# Altium project MBOARD.PRJPCB
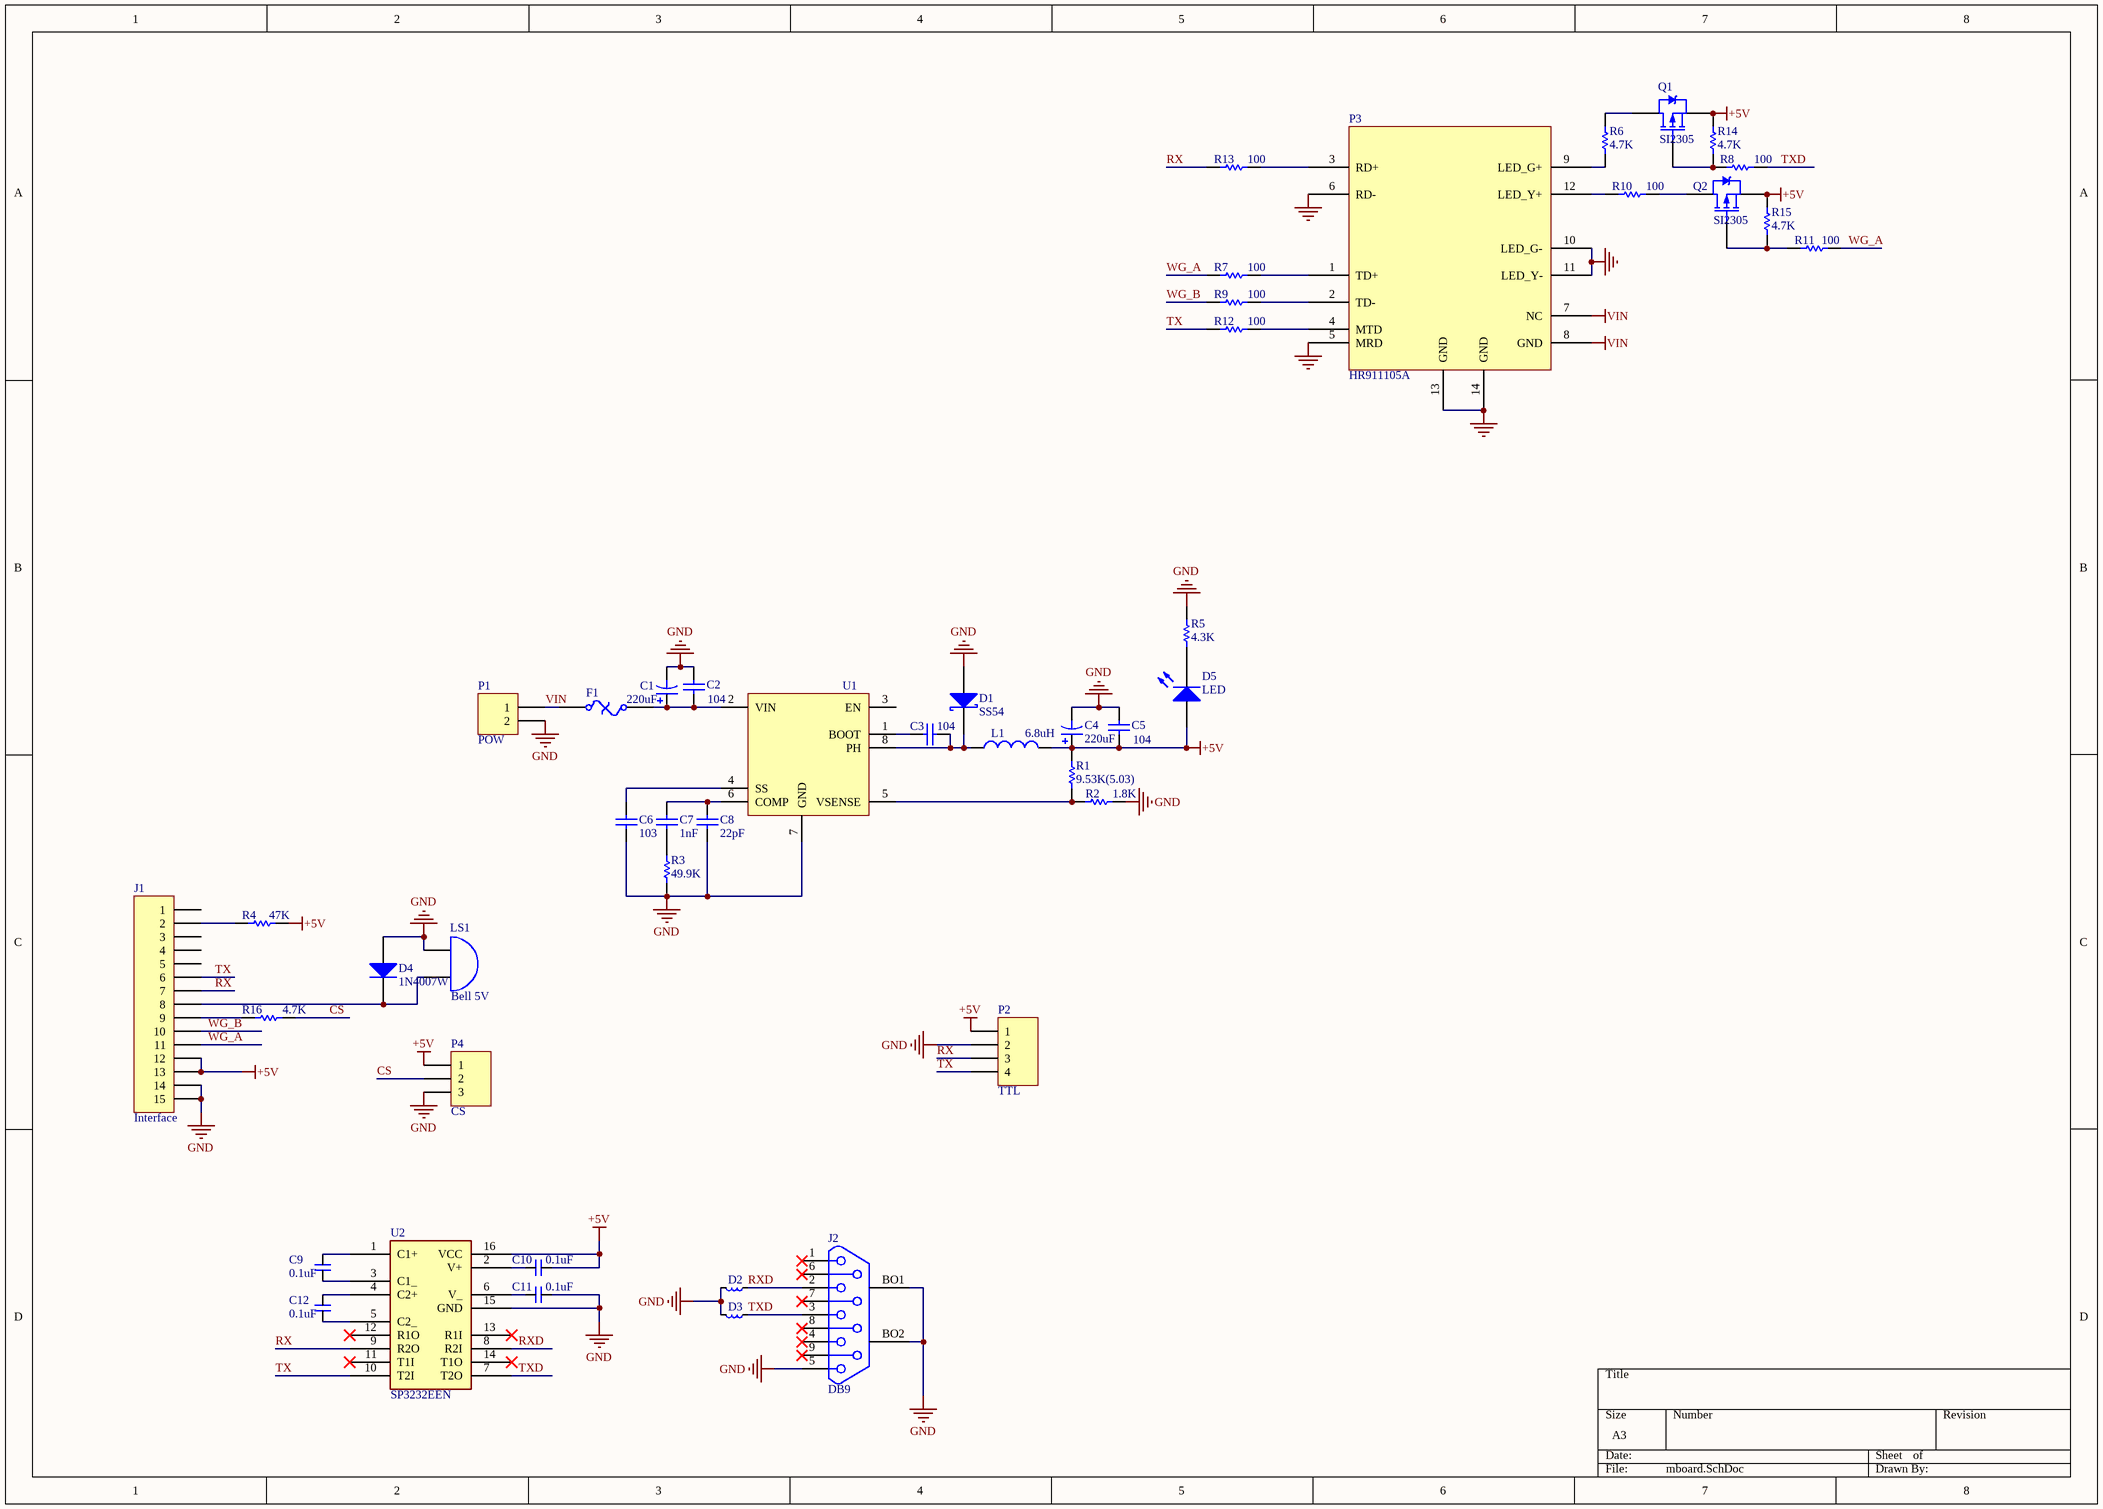
[diagram p0: mboard.SchDoc]
1 sheet, 46 parts. Net scope: global (net labels, ports and power ports of the same name join across sheets).
Board file: mboard.PcbDoc

## Sheet mboard.SchDoc
size A3

### Parts
C1  value 220uF  [C8x10-SMD]  (hidden comment: Cap Pol1)
C2  value 104  [0603C]  (hidden comment: Cap)
C3  value 104  [0603C]  (hidden comment: Cap)
C4  value 220uF  [C6.3x5.4-SMD]  (hidden comment: Cap Pol1)
C5  value 104  [0603C]  (hidden comment: Cap)
C6  value 103  [0603C]  (hidden comment: Cap)
C7  value 1nF  [0603C]  (hidden comment: Cap)
C8  value 22pF  [0603C]  (hidden comment: Cap)
C9  0.1uF  [0603C]
C10  0.1uF  [0603C]
C11  0.1uF  [0603C]
C12  0.1uF  [0603C]
D1  SS54  [SMA]
D2  ESD  [0603L]  (value not drawn)
D3  ESD  [0603L]  (value not drawn)
D4  1N4007W  [SOD-123]
D5  LED  [0603-LED]
F1  Fuse Thermal  [1812F]  (value not drawn)
J1  Interface  [1.25-15P]
J2  DB9  [DB-9/M]
L1  value 6.8uH  [L-6045]  (hidden comment: Inductor)
LS1  value Bell 5V  [BEEP-9x5.5]  (hidden comment: Bell)
P1  POW  [DC-005]
P2  TTL  [XH2.54-4P]
P3  HR911105A  [RJ-45]
P4  CS  [HDR1X3]
Q1  SI2305  [SOT-23-PMOS]
Q2  SI2305  [SOT-23-PMOS]
R1  value 9.53K(5.03)  [0603R]  (hidden comment: Res Semi)
R2  value 1.8K  [0603R]  (hidden comment: Res Semi)
R3  value 49.9K  [0603]  (hidden comment: Res Semi)
R4  value 47K  [0603R]  (hidden comment: Res Semi)
R5  value 4.3K  [0603R]  (hidden comment: Res1)
R6  value 4.7K  [0603]  (hidden comment: Res Semi)
R7  value 100  [0603]  (hidden comment: Res Semi)
R8  value 100  [0603]  (hidden comment: Res Semi)
R9  value 100  [0603]  (hidden comment: Res Semi)
R10  value 100  [0603]  (hidden comment: Res Semi)
R11  value 100  [0603]  (hidden comment: Res Semi)
R12  value 100  [0603]  (hidden comment: Res Semi)
R13  value 100  [0603]  (hidden comment: Res Semi)
R14  value 4.7K  [0603]  (hidden comment: Res Semi)
R15  value 4.7K  [0603]  (hidden comment: Res Semi)
R16  value 4.7K  [0603]  (hidden comment: Res Semi)
U1  TPS54331  [SOP8-POW]  (value not drawn)
U2  SP3232EEN  [SOIC16-1.27]

### Nets
+5V: C4.1 C5.1 C10.2 D5.1(A) J1.12 J1.13 L1.2 P2.1 P4.1 Q1.2(S) Q2.2(S) R1.2 R4.1 R14.1 R15.1 U2.16(VCC)
GND: C1.2 C2.2 C4.2 C5.2 C6.2 C8.1 C11.2 D1.1(A) D2.2 D3.2 D4.1(A) J1.14 J1.15 J2.5 J2.BO1 J2.BO2 LS1.1(A) P1.2 P2.2 P3.5(MRD) P3.6(RD-) P3.10(LED_G-) P3.11(LED_Y-) P3.13(GND) P3.14(GND) P4.3 R2.2 R3.1 R5.1 U1.7(GND) U1.9(12) U2.15(GND)
VIN: F1.1 P1.1 P3.7(NC) P3.8(GND)
CS: P4.2 R16.2
RX: J1.7 P2.3 R13.2 U2.9(R2O)
RXD: D2.1 J2.2 U2.8(R2I)
TX: J1.6 P2.4 R12.2 U2.10(T2I)
TXD: D3.1 J2.3 R8.1 U2.7(T2O)
WG_A: J1.11 R7.2 R11.1
WG_B: J1.10 R9.2
NetC1_1: C1.1 C2.1 F1.2 U1.2(VIN)
NetC3_1: C3.1 D1.2(K) L1.1 U1.8(PH)
NetC3_2: C3.2 U1.1(BOOT)
NetC6_1: C6.1 U1.4(SS)
NetC7_1: C7.1 R3.2
NetC7_2: C7.2 C8.2 U1.6(COMP)
NetC9_1: C9.1 U2.1(C1+)
NetC9_2: C9.2 U2.3(C1_)
NetC10_1: C10.1 U2.2(V+)
NetC11_1: C11.1 U2.6(V_)
NetC12_1: C12.1 U2.4(C2+)
NetC12_2: C12.2 U2.5(C2_)
NetD4_2: D4.2(K) J1.8 LS1.2(B)
NetD5_2: D5.2(K) R5.2
NetJ1_2: J1.2 R4.2
NetJ1_9: J1.9 R16.1
NetP3_1: P3.1(TD+) R7.1
NetP3_2: P3.2(TD-) R9.1
NetP3_3: P3.3(RD+) R13.1
NetP3_4: P3.4(MTD) R12.1
NetP3_9: P3.9(LED_G+) R6.2
NetP3_12: P3.12(LED_Y+) R10.2
NetQ1_1: Q1.1(G) R8.2 R14.2
NetQ1_3: Q1.3(D) R6.1
NetQ2_1: Q2.1(G) R11.2 R15.2
NetQ2_3: Q2.3(D) R10.1
NetR1_1: R1.1 R2.1 U1.5(VSENSE)

Not connected (* = marked no-connect by the designer): J1 1 3 4 5; J2 1* 4* 6* 7* 8* 9*; U1 3(EN); U2 11(T1I)* 12(R1O)* 13(R1I)* 14(T1O)*

### Library data of the parts
C1 C4 = Cap Pol1: Polarized Capacitor (Radial); Published: 8-Jun-2000; LatestRevisionDate: 17-Jul-2002; LatestRevisionNote: Re-released for DXP Platform.; PackageReference: RB7.6-15; Publisher: Altium Limited; PackageDescription: Polarized Capacitor (Radial); 2 Leads
C2 C3 C5-C8 = Cap: Capacitor; Published: 8-Jun-2000; LatestRevisionDate: 17-Jul-2002; LatestRevisionNote: Re-released for DXP Platform.; PackageReference: RAD-0.3; Publisher: Altium Limited; PackageDescription: Radial Cap, Thru-Hole; 2 Leads; 0.3 in Pin Spacing
C9-C12 = 电容
D1 = D Schottky: Schottky Diode; Published: 8-Jun-2000; LatestRevisionDate: 17-Jul-2002; LatestRevisionNote: Re-released for DXP Platform.; PackageReference: SMB; Publisher: Altium Limited; PackageDescription: DO-214-AA/SMB; 2 C-Bend Leads; Body 5.3 x 3.6 mm, inc. leads (LxW); Code_JEDEC: DO-214-AA
D2 D3 = 电感
D4 = Diode 1N5408: 3 Amp Medium Power Silicon Rectifier Diode; Value: SS54; Published: 8-Jun-2000; LatestRevisionDate: 17-Jul-2002; LatestRevisionNote: Re-released for DXP Platform.; DatasheetDocument: Aug-1984; PackageReference: DO-201AD; Publisher: Altium Limited; ComponentLink1Description: Manufacturer Link; ComponentLink1URL: http://www.irf.com/
D5 = LED1: Typical RED GaAs LED; Published: 8-Jun-2000; LatestRevisionDate: 08-Jul-2005; LatestRevisionNote: Mech Layer 1 removed.; PackageReference: LED-1; Publisher: Altium Limited
F1 = Fuse Thermal: Thermal Fuse; Published: 24-Mar-1999; LatestRevisionDate: 17-Jul-2002; LatestRevisionNote: Re-released for DXP Platform.; PackageReference: PIN-W2/E2.8; Publisher: Altium Limited; PackageDescription: Thru-Hole; 2 Leads
J1 = Header 15: Header, 15-Pin; LatestRevisionDate: 17-Jul-2002; LatestRevisionNote: Re-released for DXP Platform.; Publisher: Altium Limited
L1 = Inductor: Code_IEC: 1005; Published: 8-Jun-2000; LatestRevisionDate: 29-May-2009; LatestRevisionNote: IPC-7351 Footprint Added.; PackageReference: 0402-A; Publisher: Altium Limited; PackageDescription: Chip Inductor; Code_JEITA: 0402
LS1 = Bell: Electrical Bell; pin to pad: 1>2 2>1; Published: 24-Mar-1999; LatestRevisionDate: 17-Jul-2002; LatestRevisionNote: Re-released for DXP Platform.; PackageReference: PIN2; Publisher: Altium Limited
P1 = Header 2: Header, 2-Pin; LatestRevisionDate: 17-Jul-2002; LatestRevisionNote: Re-released for DXP Platform.; Publisher: Altium Limited
P2 = Header 4: Header, 4-Pin; LatestRevisionDate: 17-Jul-2002; LatestRevisionNote: Re-released for DXP Platform.; Publisher: Altium Limited
P4 = Header 3: Header, 3-Pin; LatestRevisionDate: 17-Jul-2002; LatestRevisionNote: Re-released for DXP Platform.; Publisher: Altium Limited
Q1 Q2 = IRF9Z14S: HEXFET P-Channel Power MOSFET; Published: 8-Jun-2000; LatestRevisionDate: 17-Jul-2002; LatestRevisionNote: Re-released for DXP Platform.; DatasheetVersion: Aug-1997; PackageReference: D2PAK; Publisher: Altium Limited; PackageDescription: D2-PAK/TO-263-AB; 3 Leads (1 Cropped); Body 15.5 (inc. leads) x 10.5 mm (LxW max); ComponentLink1Description: Manufacturer Link; ComponentLink1URL: http://www.irf.com/; ComponentLink2Description: Datasheet; ComponentLink2URL: http://www.irf.com/product-info/datasheets/data/irf9z14s.pdf
R1-R4 R6-R16 = Res Semi: Semiconductor Resistor; Published: 8-Jun-2000; LatestRevisionDate: 17-Jul-2002; LatestRevisionNote: Re-released for DXP Platform.; PackageReference: AXIAL-0.5; Publisher: Altium Limited; PackageDescription: Axial Device, Thru-Hole; 2 Leads; 0.5 in Pin Spacing
R5 = Res1: Resistor; Published: 8-Jun-2000; LatestRevisionDate: 17-Jul-2002; LatestRevisionNote: Re-released for DXP Platform.; PackageReference: AXIAL-0.3; Publisher: Altium Limited
U2 = MAX232ESE: Text Field1: MAXIM; Text Field2: RS232; MAXIM: *